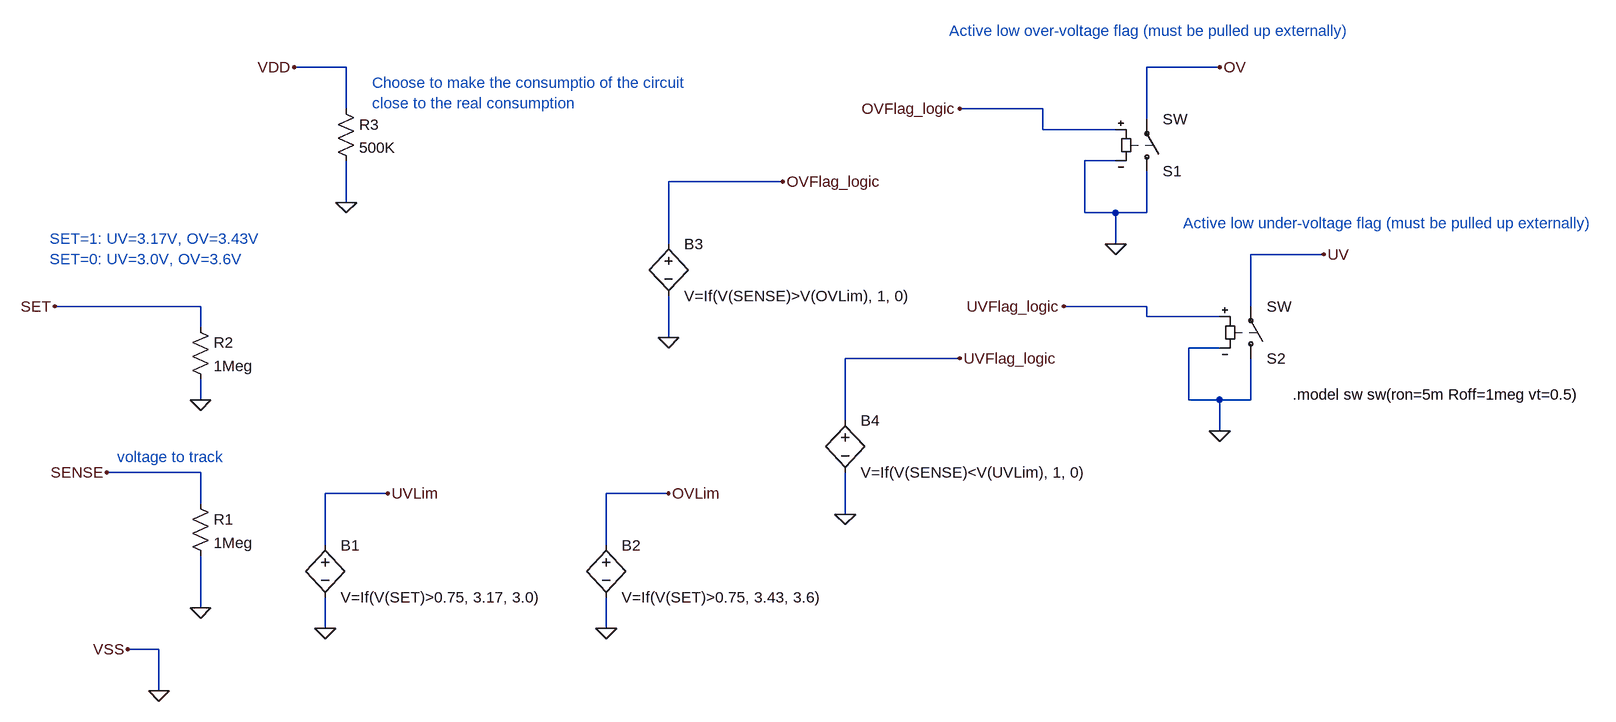
[diagram p0: schematic TPS3702CX33DDCR.asc]
TPS3702CX33DDCR.asc, the LTspice schematic file:
Version 4
SHEET 1 2456 680
WIRE 464 -448 384 -448
WIRE 1808 -448 1696 -448
WIRE 464 -384 464 -448
WIRE 1536 -384 1408 -384
WIRE 1696 -368 1696 -448
WIRE 1536 -352 1536 -384
WIRE 1648 -352 1536 -352
WIRE 1648 -304 1600 -304
WIRE 1136 -272 960 -272
WIRE 464 -240 464 -304
WIRE 1600 -224 1600 -304
WIRE 1648 -224 1600 -224
WIRE 1696 -224 1696 -288
WIRE 1696 -224 1648 -224
WIRE 960 -176 960 -272
WIRE 1648 -176 1648 -224
WIRE 1968 -160 1856 -160
WIRE 240 -80 16 -80
WIRE 1696 -80 1568 -80
WIRE 1856 -80 1856 -160
WIRE 1696 -64 1696 -80
WIRE 1808 -64 1696 -64
WIRE 240 -48 240 -80
WIRE 960 -32 960 -96
WIRE 1808 -16 1760 -16
WIRE 1408 0 1232 0
WIRE 240 64 240 32
WIRE 1760 64 1760 -16
WIRE 1808 64 1760 64
WIRE 1856 64 1856 0
WIRE 1856 64 1808 64
WIRE 1232 96 1232 0
WIRE 1808 112 1808 64
WIRE 240 176 96 176
WIRE 528 208 432 208
WIRE 960 208 864 208
WIRE 240 224 240 176
WIRE 1232 240 1232 176
WIRE 432 288 432 208
WIRE 864 288 864 208
WIRE 240 384 240 304
WIRE 432 416 432 368
WIRE 864 416 864 368
WIRE 176 448 128 448
WIRE 176 512 176 448
FLAG 96 176 SENSE
FLAG 240 384 0
FLAG 432 416 0
FLAG 16 -80 SET
FLAG 240 64 0
FLAG 528 208 UVLim
FLAG 864 416 0
FLAG 960 208 OVLim
FLAG 960 -32 0
FLAG 1136 -272 OVFlag_logic
FLAG 1232 240 0
FLAG 1408 0 UVFlag_logic
FLAG 1648 -176 0
FLAG 1808 -448 OV
FLAG 1808 112 0
FLAG 1968 -160 UV
FLAG 1408 -384 OVFlag_logic
FLAG 1568 -80 UVFlag_logic
FLAG 384 -448 VDD
FLAG 464 -240 0
FLAG 128 448 VSS
FLAG 176 512 0
SYMBOL res 224 208 R0
SYMATTR InstName R1
SYMATTR Value 1Meg
SYMBOL bv 432 272 R0
SYMATTR InstName B1
SYMATTR Value V=If(V(SET)>0.75, 3.17, 3.0)
SYMBOL res 224 -64 R0
SYMATTR InstName R2
SYMATTR Value 1Meg
SYMBOL bv 864 272 R0
SYMATTR InstName B2
SYMATTR Value V=If(V(SET)>0.75, 3.43, 3.6)
SYMBOL bv 960 -192 R0
SYMATTR InstName B3
SYMATTR Value V=If(V(SENSE)>V(OVLim), 1, 0)
SYMBOL bv 1232 80 R0
SYMATTR InstName B4
SYMATTR Value V=If(V(SENSE)<V(UVLim), 1, 0)
SYMBOL sw 1696 -272 M180
SYMATTR InstName S1
SYMBOL sw 1856 16 M180
SYMATTR InstName S2
SYMBOL res 448 -400 R0
SYMATTR InstName R3
SYMATTR Value 500K
TEXT 112 152 Left 2 ;voltage to track
TEXT 8 -184 Left 2 ;SET=1: UV=3.17V, OV=3.43V\nSET=0: UV=3.0V, OV=3.6V
TEXT 504 -424 Left 2 ;Choose to make the consumptio of the circuit\nclose to the real consumption
TEXT 1392 -504 Left 2 ;Active low over-voltage flag (must be pulled up externally)
TEXT 1752 -208 Left 2 ;Active low under-voltage flag (must be pulled up externally)
TEXT 1920 56 Left 2 !.model sw sw(ron=5m Roff=1meg vt=0.5)

The netlist it stands for:
* TPS3702CX33DDCR.asc
R1 SENSE 0 1Meg
B1 UVLim 0 V=If(V(SET)>0.75, 3.17, 3.0)
R2 SET 0 1Meg
B2 OVLim 0 V=If(V(SET)>0.75, 3.43, 3.6)
B3 OVFlag_logic 0 V=If(V(SENSE)>V(OVLim), 1, 0)
B4 UVFlag_logic 0 V=If(V(SENSE)<V(UVLim), 1, 0)
S1 0 OV OVFlag_logic 0 SW
S2 0 UV UVFlag_logic 0 SW
R3 VDD 0 500K
* voltage to track
* SET=1: UV=3.17V, OV=3.43V
* SET=0: UV=3.0V, OV=3.6V
* Choose to make the consumptio of the circuit
* close to the real consumption
* Active low over-voltage flag (must be pulled up externally)
* Active low under-voltage flag (must be pulled up externally)
.model sw sw(ron=5m Roff=1meg vt=0.5)
.backanno
.end